# Altium schematic sheet radio.SchDoc
size A4
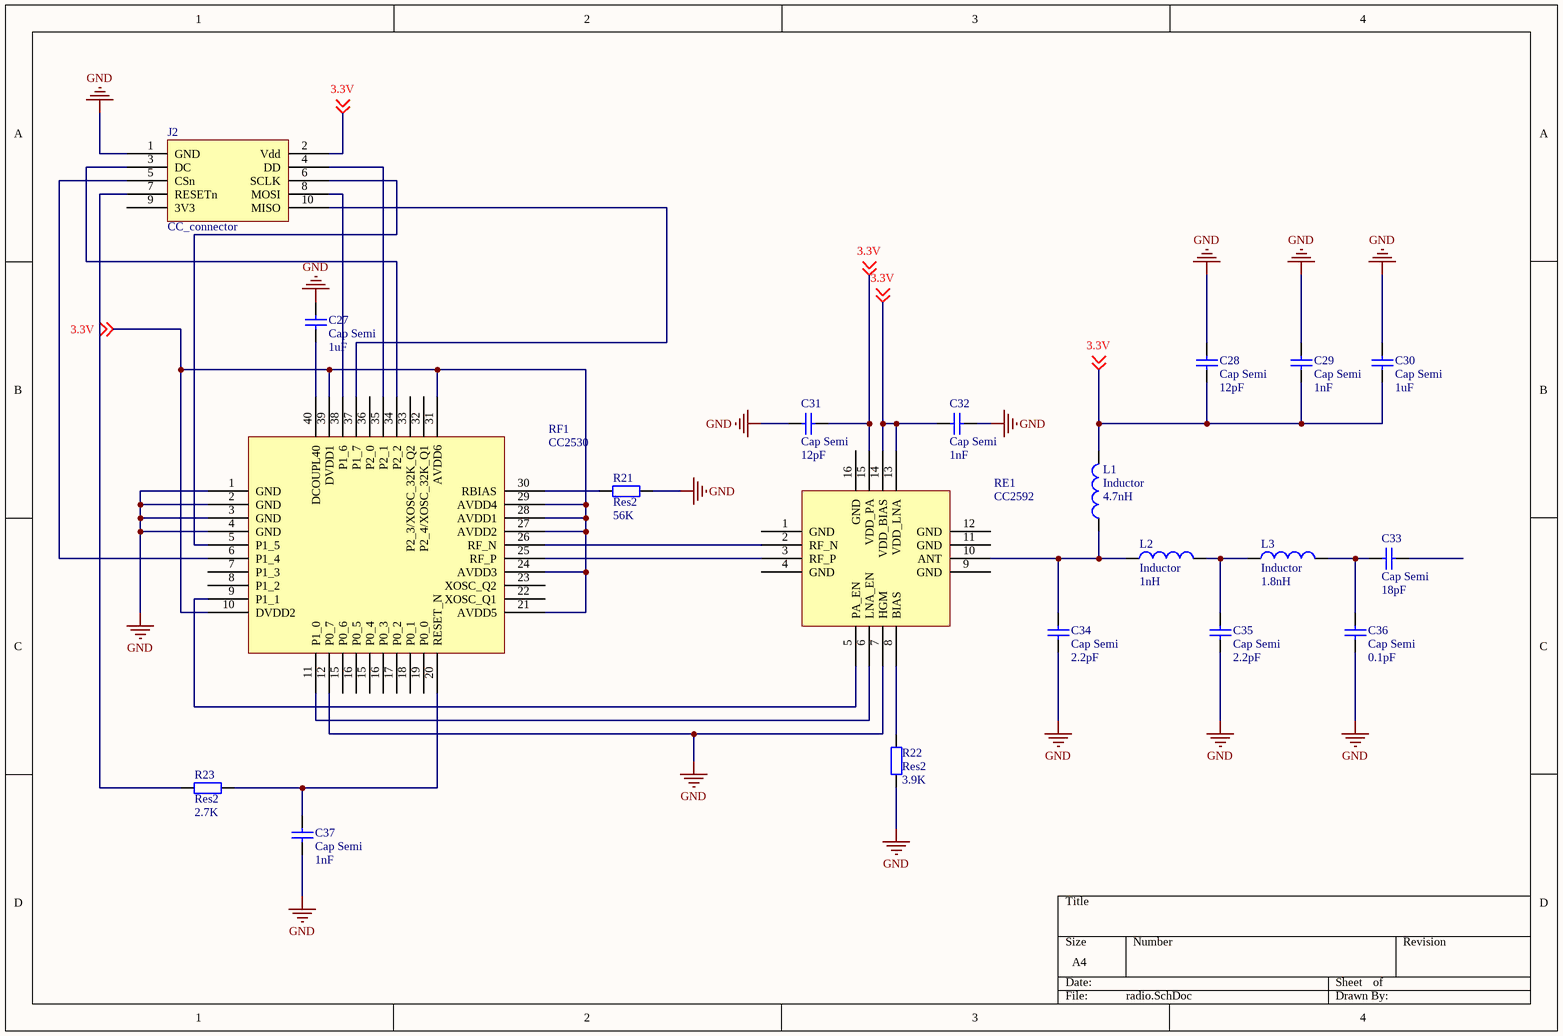
[diagram p0: radio.SchDoc]

## Parts
C27  Cap Semi  value 1uF  [C1206]
C28  Cap Semi  value 12pF  [C1206]
C29  Cap Semi  value 1nF  [C1206]
C30  Cap Semi  value 1uF  [C1206]
C31  Cap Semi  value 12pF  [C1206]
C32  Cap Semi  value 1nF  [C1206]
C33  Cap Semi  value 18pF  [C1206]
C34  Cap Semi  value 2.2pF  [C1206]
C35  Cap Semi  value 2.2pF  [C1206]
C36  Cap Semi  value 0.1pF  [C1206]
C37  Cap Semi  value 1nF  [C1206]
J2  CC_connector
L1  Inductor  value 4.7nH  [0402-A]
L2  Inductor  value 1nH  [0402-A]
L3  Inductor  value 1.8nH  [0402-A]
R21  Res2  value 56K  [AXIAL-0.4]
R22  Res2  value 3.9K  [AXIAL-0.4]
R23  Res2  value 2.7K  [AXIAL-0.4]
RE1  CC2592
RF1  CC2530

## Nets
GND: C27.1 C28.2 C29.2 C30.2 C31.1 C32.2 C34.1 C35.1 C36.1 C37.1 J2.1(GND) R21.1 R22.2 RE1.7(HGM) RF1.1(GND) RF1.2(GND) RF1.3(GND) RF1.4(GND) RF1.12(P0_7)
3.3V: C28.1 C29.1 C30.1 C31.2 C32.1 J2.2(Vdd) L1.2 RE1.13(VDD_LNA) RE1.14(VDD_BIAS) RE1.15(VDD_PA) RF1.10(DVDD2) RF1.21(AVDD5) RF1.24(AVDD3) RF1.27(AVDD2) RF1.28(AVDD1) RF1.29(AVDD4) RF1.31(AVDD6) RF1.39(DVDD1) ; off-sheet 3.3V
NetC27_2: C27.2 RF1.40(DCOUPL40)
NetC33_1: C33.1 C36.2 L3.2
NetC34_2: C34.2 L1.1 L2.1 RE1.10(ANT)
NetC35_2: C35.2 L2.2 L3.1
NetC37_2: C37.2 R23.1 RF1.20(RESET_N)
NetJ2_3: J2.3(DC) RF1.34(P2_2)
NetJ2_4: J2.4(DD) RF1.35(P2_1)
NetJ2_5: J2.5(CSn) RF1.6(P1_4)
NetJ2_6: J2.6(SCLK) RF1.5(P1_5)
NetJ2_7: J2.7(RESETn) R23.2
NetJ2_8: J2.8(MOSI) RF1.38(P1_6)
NetJ2_10: J2.10(MISO) RF1.37(P1_7)
NetR21_2: R21.2 RF1.30(RBIAS)
NetR22_1: R22.1 RE1.8(BIAS)
NetRE1_2: RE1.2(RF_N) RF1.26(RF_N)
NetRE1_3: RE1.3(RF_P) RF1.25(RF_P)
NetRE1_5: RE1.5(PA_EN) RF1.9(P1_1)
NetRE1_6: RE1.6(LNA_EN) RF1.11(P1_0)

Not connected (* = marked no-connect by the designer): C33 2; J2 9(3V3); RE1 1(GND) 4(GND) 9(GND) 11(GND) 12(GND) 16(GND); RF1 7(P1_3) 8(P1_2) 15(P0_6) 16(P0_5) 17(P0_2) 18(P0_1) 19(P0_0) 22(XOSC_Q1) 23(XOSC_Q2) 32(P2_4/XOSC_32K_Q1) 33(P2_3/XOSC_32K_Q2) 36(P2_0)

## Library data of the parts
C27-C37 = Cap Semi: Capacitor (Semiconductor SIM Model); Published: 8-Jun-2000; LatestRevisionDate: 29-May-2009; LatestRevisionNote: IPC-7351 Footprint Added.; PackageReference: C1206; Publisher: Altium Limited; PackageDescription: Chip Capacitor
J2 = CC_connector: CC Debugger TI connector
L1-L3 = Inductor: Code_IEC: 1005; Published: 8-Jun-2000; LatestRevisionDate: 29-May-2009; LatestRevisionNote: IPC-7351 Footprint Added.; PackageReference: 0402-A; Publisher: Altium Limited; PackageDescription: Chip Inductor; Code_JEITA: 0402
R21-R23 = Res2: Resistor; Published: 8-Jun-2000; LatestRevisionDate: 17-Jul-2002; LatestRevisionNote: Re-released for DXP Platform.; PackageReference: AXIAL-0.4; Publisher: Altium Limited; PackageDescription: Axial Device, Thru-Hole; 2 Leads; 0.4 in Pin Spacing
RE1 = CC2592: Range Extender 2.5GHz
RF1 = CC2530: RF 2.5GHz module